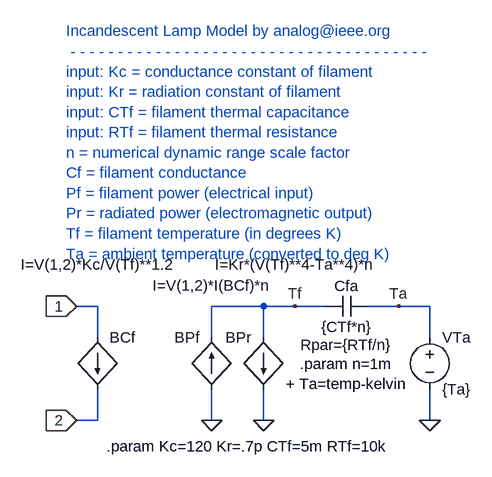
[diagram p0: schematic Lamp2.asc]
Lamp2.asc, the LTspice schematic file:
Version 4
SHEET 1 880 680
WIRE 0 432 0 384
WIRE 0 304 0 256
WIRE 256 384 256 432
WIRE -256 256 -256 304
WIRE -256 384 -256 432
WIRE -256 432 -288 432
WIRE -288 256 -256 256
WIRE 256 256 256 304
WIRE 96 256 48 256
WIRE 256 256 208 256
WIRE -80 304 -80 256
WIRE -80 256 0 256
WIRE -80 384 -80 432
WIRE 208 256 160 256
WIRE 48 256 0 256
FLAG 0 432 0
FLAG 256 432 0
FLAG 48 256 Tf
FLAG 208 256 Ta
FLAG -288 256 1
IOPIN -288 256 In
FLAG -288 432 2
IOPIN -288 432 In
FLAG -80 432 0
SYMBOL bi -80 384 R180
WINDOW 0 19 80 Left 0
WINDOW 3 0 160 Center 0
SYMATTR InstName BPf
SYMATTR Value I=V(1,2)*I(BCf)*n
SYMBOL cap 96 272 R270
WINDOW 0 32 32 VTop 0
WINDOW 3 0 32 VBottom 0
WINDOW 39 -28 32 VBottom 0
SYMATTR InstName Cfa
SYMATTR Value {CTf*n}
SYMATTR SpiceLine Rpar={RTf/n}
SYMBOL voltage 256 288 R0
WINDOW 3 19 96 Left 0
WINDOW 0 19 16 Left 0
SYMATTR Value {Ta}
SYMATTR InstName VTa
SYMBOL bi -256 304 R0
WINDOW 3 0 -112 Center 0
WINDOW 0 19 0 Left 0
SYMATTR Value I=V(1,2)*Kc/V(Tf)**1.2
SYMATTR InstName BCf
SYMBOL bi 0 304 M0
WINDOW 0 19 0 Left 0
WINDOW 3 -48 -112 Center 0
SYMATTR InstName BPr
SYMATTR Value I=Kr*(V(Tf)**4-Ta**4)*n
TEXT -24 472 Center 0 !.param Kc=120 Kr=.7p CTf=5m RTf=10k
TEXT -304 -168 Left 0 ;Incandescent Lamp Model by analog@ieee.org\n - - - - - - - - - - - - - - - - - - - - - - - - - - - - - - - - - - - - - -\ninput: Kc = conductance constant of filament\ninput: Kr = radiation constant of filament\ninput: CTf = filament thermal capacitance\ninput: RTf = filament thermal resistance\nn = numerical dynamic range scale factor\nCf = filament conductance\nPf = filament power (electrical input)\nPr = radiated power (electromagnetic output)\nTf = filament temperature (in degrees K)\nTa = ambient temperature (converted to deg K)
TEXT 128 360 Center 0 !.param n=1m\n+ Ta=temp-kelvin

The netlist it stands for:
* Lamp2.asc
BPf 0 Tf I=V(1,2)*I(BCf)*n
Cfa Tf Ta {CTf*n} Rpar={RTf/n}
VTa Ta 0 {Ta}
BCf 1 2 I=V(1,2)*Kc/V(Tf)**1.2
BPr Tf 0 I=Kr*(V(Tf)**4-Ta**4)*n
.param Kc=120 Kr=.7p CTf=5m RTf=10k
* Incandescent Lamp Model by analog@ieee.org
*  - - - - - - - - - - - - - - - - - - - - - - - - - - - - - - - - - - - - - -
* input: Kc = conductance constant of filament
* input: Kr = radiation constant of filament
* input: CTf = filament thermal capacitance
* input: RTf = filament thermal resistance
* n = numerical dynamic range scale factor
* Cf = filament conductance
* Pf = filament power (electrical input)
* Pr = radiated power (electromagnetic output)
* Tf = filament temperature (in degrees K)
* Ta = ambient temperature (converted to deg K)
.param n=1m
+ Ta=temp-kelvin
.backanno
.end